# Altium schematic sheet PowerDriver.SchDoc: 3D Printer Power Driver
size A; Author: Łukasz Weber
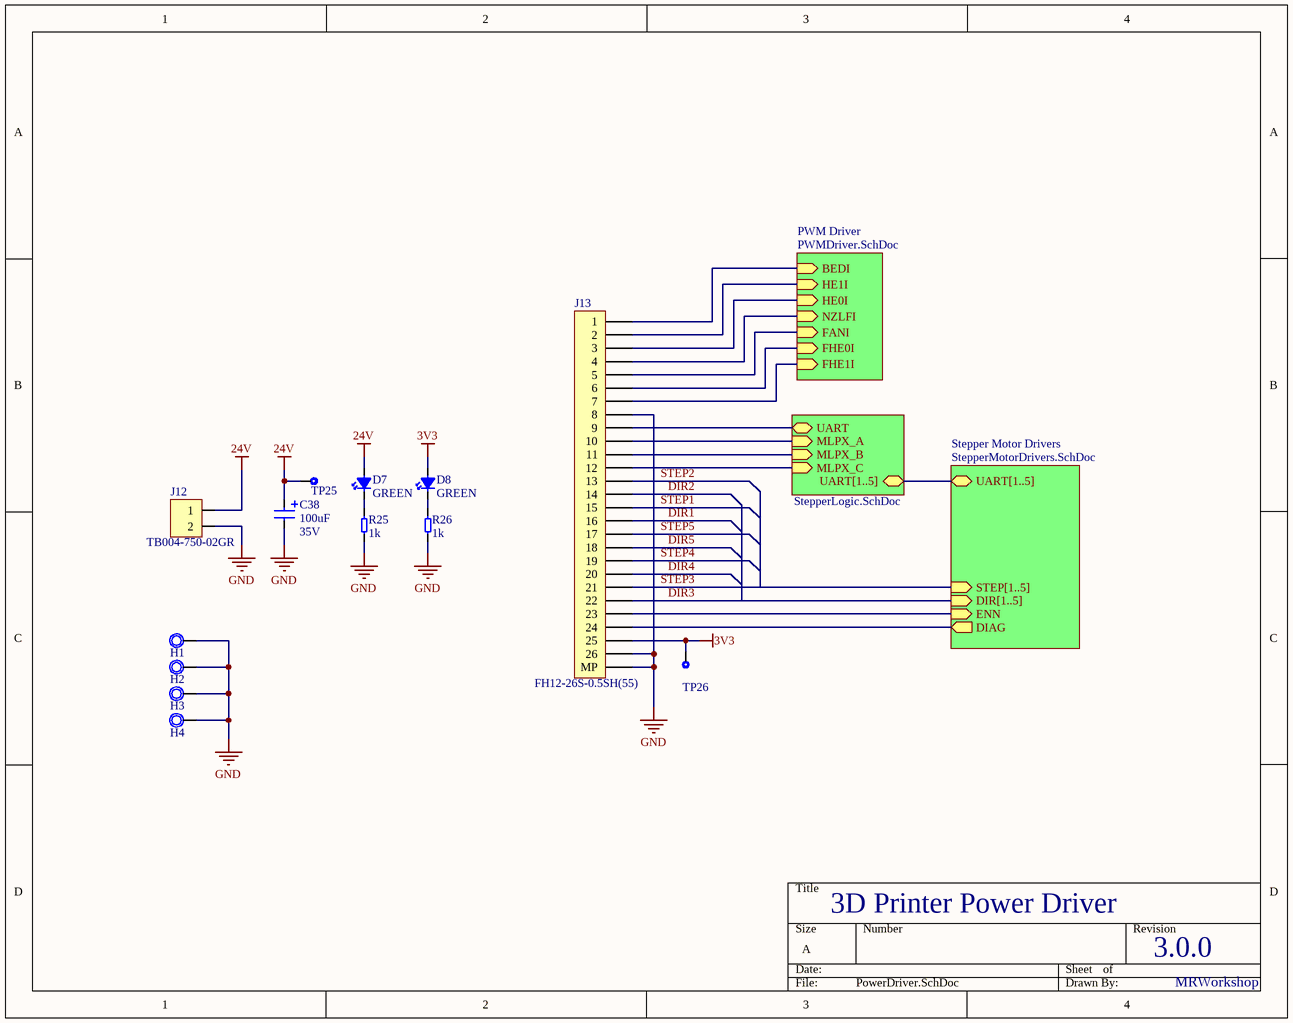
[diagram p0: PowerDriver.SchDoc]

## Parts
C38  value 100uF  Voltage: 35V  [C_8.3x10.5]  (hidden comment: EDT107M035S9MAA)
D7  GREEN  [LED_0402]
D8  GREEN  [LED_0402]
H1  Mounting_Hole_M3  [M3]  (value not drawn)
H2  Mounting_Hole_M3  [M3]  (value not drawn)
H3  Mounting_Hole_M3  [M3]  (value not drawn)
H4  Mounting_Hole_M3  [M3]  (value not drawn)
J12  TB004-750-02GR  [TB004-750-02GR]
J13  FH12-26S-0.5SH(55)  [FH12-26S-0.5SH(55)]
R25  value 1k  [R_0402]  (hidden comment: CR0402-FX-1001GLF)
R26  value 1k  [R_0402]  (hidden comment: CR0402-FX-1001GLF)
TP25  TestPoint_1mm  [TestPoint_1mm]  (value not drawn)
TP26  TestPoint_1mm  [TestPoint_1mm]  (value not drawn)

## Sub-sheets
PWM Driver = PWMDriver.SchDoc: FHE1I (in), HE0I (in), BEDI (in), FANI (in), NZLFI (in), FHE0I (in), HE1I (in)
Stepper Logic = StepperLogic.SchDoc: UART[1..5] (bidir), UART (bidir), MLPX_A (in), MLPX_B (in), MLPX_C (in)
Stepper Motor Drivers = StepperMotorDrivers.SchDoc: STEP[1..5] (in), DIAG (out), UART[1..5] (bidir), DIR[1..5] (in), ENN (in)

## Nets
3V3: D8.2 J13.25 TP26.1
24V: C38.1 D7.2 J12.1 TP25.1
GND: C38.2 H1.1 H2.1 H3.1 H4.1 J12.2 J13.0(MP) J13.8 J13.26 R25.1 R26.1
DIR1: J13.16
DIR2: J13.14
DIR3: J13.22
DIR4: J13.20
DIR5: J13.18
STEP1: J13.15
STEP2: J13.13
STEP3: J13.21
STEP4: J13.19
STEP5: J13.17
NetD7_1: D7.1 R25.2
NetD8_1: D8.1 R26.2
NetJ13_1: J13.1 ; sheet PWM Driver/BEDI
NetJ13_2: J13.2 ; sheet PWM Driver/HE1I
NetJ13_3: J13.3 ; sheet PWM Driver/HE0I
NetJ13_4: J13.4 ; sheet PWM Driver/NZLFI
NetJ13_5: J13.5 ; sheet PWM Driver/FANI
NetJ13_6: J13.6 ; sheet PWM Driver/FHE0I
NetJ13_7: J13.7 ; sheet PWM Driver/FHE1I
NetJ13_9: J13.9 ; sheet Stepper Logic/UART
NetJ13_10: J13.10 ; sheet Stepper Logic/MLPX_A
NetJ13_11: J13.11 ; sheet Stepper Logic/MLPX_B
NetJ13_12: J13.12 ; sheet Stepper Logic/MLPX_C
NetJ13_23: J13.23 ; sheet Stepper Motor Drivers/ENN
NetJ13_24: J13.24 ; sheet Stepper Motor Drivers/DIAG

## Buses and harness runs
bus sheet Stepper Logic/UART[1..5] = sheet Stepper Motor Drivers/UART[1..5]

## Notes on the sheet
- 3D Printer Power Driver
- 3.0.0
- MRWorkshop

## Library data of the parts
C38 = EDT107M035S9MAA: Aluminum Electrolytic Capacitors - SMD 35V 100uF 20% AEC-Q200
D7 D8 = APHHS1005CGCK: Single Colour LEDs GREEN WTR CLEAR 40mcd 574nm; Supplier 1: Digikey; Supplier Part Number 1: 754-1101-1-ND
J12 = TB004-750-02GR: Fixed Terminal Blocks 2 Poles, Screw Type, Horizontal, 7.50 mm Pitch, 24-12 (AWG); Supplier 1: Digikey; Supplier Part Number 1: 2223-TB004-750-02GR-ND
J13 = FH12-26S-0.5SH(55): FFC & FPC Connectors 0.5MM 26 POS R/A BTTM SMT GLD; pin to pad: 0>MP; Supplier 1: Farnell; Supplier Part Number 1: 1324553
R25 R26 = CR0402-FX-1001GLF: Thick Film Resistors - SMD 1.0K OHM 1%; Power: 62.5mW; Supplier 1: Rs; Supplier Part Number 1: 2231667; Tolerance: 1%